# Altium schematic sheet SchemaAction.SchDoc: Carte Actionneurs 2024-2025
size A4; DrawnBy: Oriane Doucet; DocumentNumber: 1/2; Revision: V1; SheetNumber: 1; SheetTotal: 2
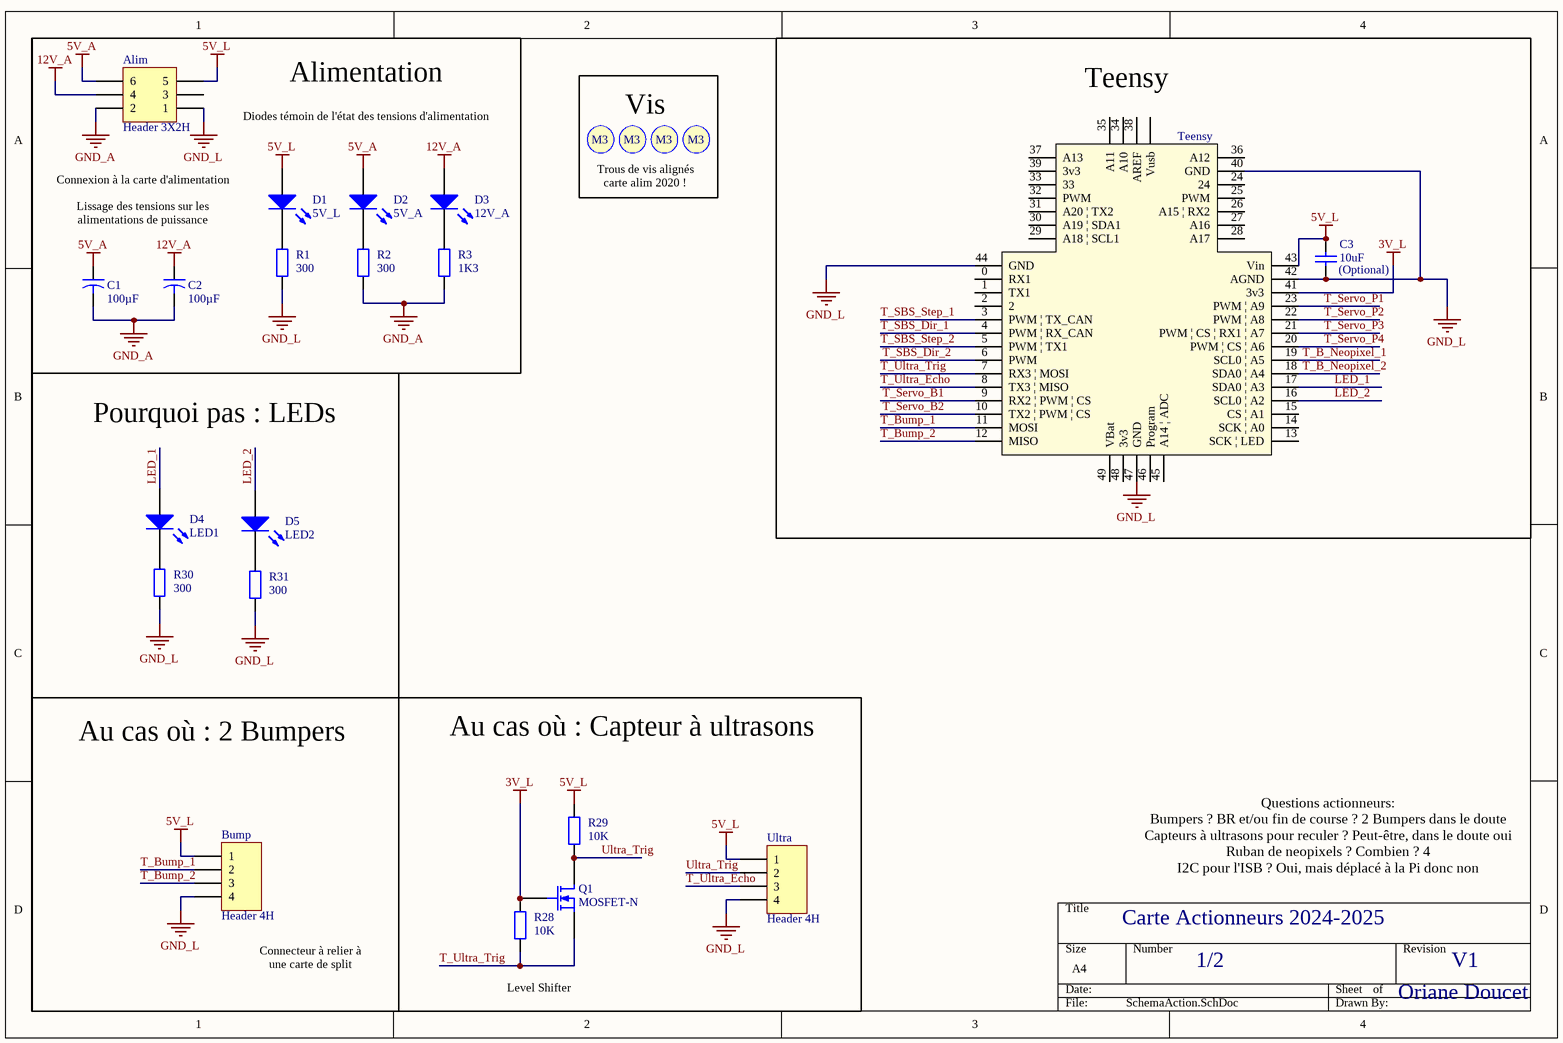
[diagram p0: SchemaAction.SchDoc]

## Parts
Alim  Header 3X2H  [MOLEX_MINIFITJR_3X2]
Bump  Header 4H  [S4B-XH-A]
C1  value 100µF  [Condensateur]  (hidden comment: Cap2)
C2  value 100µF  [Condensateur]  (hidden comment: Cap2)
C3  (Optional)  value 10uF  [Capacitor 1206]
D1  5V_L  [KP-3216SEC]
D2  5V_A  [KP-3216SEC]
D3  12V_A  [KP-3216SEC]
D4  LED1  [KP-3216SEC]
D5  LED2  [KP-3216SEC]
Q1  MOSFET-N  [SOT23_M]
R1  value 300  [Resistor 1206]  (hidden comment: Res2)
R2  value 300  [Resistor 1206]  (hidden comment: Res2)
R3  value 1K3  [Resistor 1206]  (hidden comment: Res2)
R28  value 10K  [Resistor 1206]  (hidden comment: Res2)
R29  value 10K  [Resistor 1206]  (hidden comment: Res2)
R30  value 300  [Resistor 1206]  (hidden comment: Res2)
R31  value 300  [Resistor 1206]  (hidden comment: Res2)
S1  Screw M3  [Screw M3]  (value not drawn)
S2  Screw M3  [Screw M3]  (value not drawn)
S3  Screw M3  [Screw M3]  (value not drawn)
S4  Screw M3  [Screw M3]  (value not drawn)
Teensy  Teensy 3.2  [teensy]  (value not drawn)
Ultra  Header 4H  [S4B-XH-A]

## Nets
3V_L: Q1.2(G) R28.1 Teensy.41(3v3)
5V_A: Alim.6 C1.1 D2.1(A)
5V_L: Alim.5 Bump.1 C3.2 D1.1(A) R29.1 Teensy.43(Vin) Ultra.1
12V_A: Alim.4 C2.1 D3.1(A)
GND_A: Alim.2 C1.2 C2.2 R2.2 R3.2
GND_L: Alim.1 Bump.4 C3.1 R1.1 R30.1 R31.1 Teensy.40(GND) Teensy.42(AGND) Teensy.44(GND) Teensy.47(GND) Ultra.4
LED_1: D4.1(A) Teensy.17(SDA0_|_A3)
LED_2: D5.1(A) Teensy.16(SCL0_|_A2)
T_B_Neopixel_1: Teensy.19(SCL0_|_A5)
T_B_Neopixel_2: Teensy.18(SDA0_|_A4)
T_Bump_1: Bump.2 Teensy.11(MOSI)
T_Bump_2: Bump.3 Teensy.12(MISO)
T_SBS_Dir_1: Teensy.4(PWM_|_RX_CAN)
T_SBS_Dir_2: Teensy.6(PWM)
T_SBS_Step_1: Teensy.3(PWM_|_TX_CAN)
T_SBS_Step_2: Teensy.5(PWM_|_TX1)
T_Servo_B1: Teensy.9(RX2_|_PWM_|_CS)
T_Servo_B2: Teensy.10(TX2_|_PWM_|_CS)
T_Servo_P1: Teensy.23(PWM_|_A9)
T_Servo_P2: Teensy.22(PWM_|_A8)
T_Servo_P3: Teensy.21(PWM_|_CS_|_RX1_|_A7)
T_Servo_P4: Teensy.20(PWM_|_CS_|_A6)
T_Ultra_Echo: Teensy.8(TX3_|_MISO) Ultra.3
T_Ultra_Trig: Q1.3(S) R28.2 Teensy.7(RX3_|_MOSI)
Ultra_Trig: Q1.1(D) R29.2 Ultra.2
NetD1_2: D1.2(K) R1.2
NetD2_2: D2.2(K) R2.1
NetD3_2: D3.2(K) R3.1
NetD4_2: D4.2(K) R30.2
NetD5_2: D5.2(K) R31.2

Not connected (* = marked no-connect by the designer): Alim 3; Teensy 0(RX1) 1(TX1) 2 13(SCK_|_LED) 14(SCK_|_A0) 15(CS_|_A1) 24 25(PWM) 26(A15_|_RX2) 27(A16) 28(A17) 29(A18_|_SCL1) 30(A19_|_SDA1) 31(A20_|_TX2) 32(PWM) 33 34(A10) 35(A11) 36(A12) 37(A13) 38(AREF) 39(3v3) 45(A14_|_ADC) 46(Program) 48(3v3) 49(VBat) 50(Vusb)

## Notes on the sheet
- Alimentation
- Vis
- (near Teensy) Teensy
- Connexion à la carte d'alimentation
- Diodes témoin de l'état des tensions d'alimentation
- Trous de vis alignés carte alim 2020 !
- Lissage des tensions sur les alimentations de puissance
- Pourquoi pas : LEDs
- Au cas où : 2 Bumpers
- Au cas où : Capteur à ultrasons
- Questions actionneurs:
  Bumpers ? BR et/ou fin de course ? 2 Bumpers dans le doute
  Capteurs à ultrasons pour reculer ? Peut-être, dans le doute oui
  Ruban de neopixels ? Combien ? 4
  I2C pour l'ISB ? Oui, mais déplacé à la Pi donc non
- Connecteur à relier à une carte de split
- (near R28) Level Shifter
- (in symbol Screw M3) M3

## Library data of the parts
Alim = Header 3X2H: Header, 3-Pin, Dual row, Right Angle; LatestRevisionDate: 17-Jul-2002; LatestRevisionNote: Re-released for DXP Platform.; Publisher: Altium Limited
Bump Ultra = Header 4H: Header, 4-Pin, Right Angle; LatestRevisionDate: 17-Jul-2002; LatestRevisionNote: Re-released for DXP Platform.; Publisher: Altium Limited
C1 C2 = Cap2: Capacitor; Published: 23-Sep-2002; PackageReference: CAPR5-4X5; Publisher: Altium Limited; PackageDescription: Capacitor; 2 Leads
C3 = Cap: Capacitor; Published: 8-Jun-2000; LatestRevisionDate: 17-Jul-2002; LatestRevisionNote: Re-released for DXP Platform.; PackageReference: RAD-0.3; Publisher: Altium Limited; PackageDescription: Radial Cap, Thru-Hole; 2 Leads; 0.3 in Pin Spacing
D1-D5 = LED2: Typical RED, GREEN, YELLOW, AMBER GaAs LED; Published: 8-Jun-2000; LatestRevisionDate: 17-Jul-2002; LatestRevisionNote: Re-released for DXP Platform.; PackageVersion: Feb-2002; PackageReference: 3.2X1.6X1.1; Publisher: Altium Limited; PackageDescription: SM LED; 2 Flat Leads
Q1 = MOSFET-N: N-Channel MOSFET; pin to pad: 2>3 3>2; Published: 8-Jun-2000; LatestRevisionDate: 17-Jul-2002; LatestRevisionNote: Re-released for DXP Platform.; PackageVersion: 1995/1996; PackageReference: E3; Publisher: Altium Limited; PackageDescription: TO, Flat Index; 3 In-Line, Axial Leads; Body Dia. 4.6mm; Lead Dia. 0.5 mm (max)
R1-R3 R28-R31 = Res2: Resistor; Published: 8-Jun-2000; LatestRevisionDate: 17-Jul-2002; LatestRevisionNote: Re-released for DXP Platform.; PackageReference: AXIAL-0.4; Publisher: Altium Limited; PackageDescription: Axial Device, Thru-Hole; 2 Leads; 0.4 in Pin Spacing
Teensy = teensy3.2